# Altium schematic sheet LPCB222 - SWITCH INTERFACE.SchDoc
size A3; Address1: Factory 10; Address2: 9-13 Dingley Avenue, Dandeong, VICTORIA 3175, AUSTRALIA; DocumentNumber: 3; Revision: 1; SheetNumber: 3; SheetTotal: 3; Lockie__PCB_SUB_ASSEMBLY: Switch Interface; Lockie__PCB_ASSEMBLY: Gimbal Interface; Lockie__LDL: LPCB222; Lockie__PCB_DESCRIPTION: Gimbal Interface
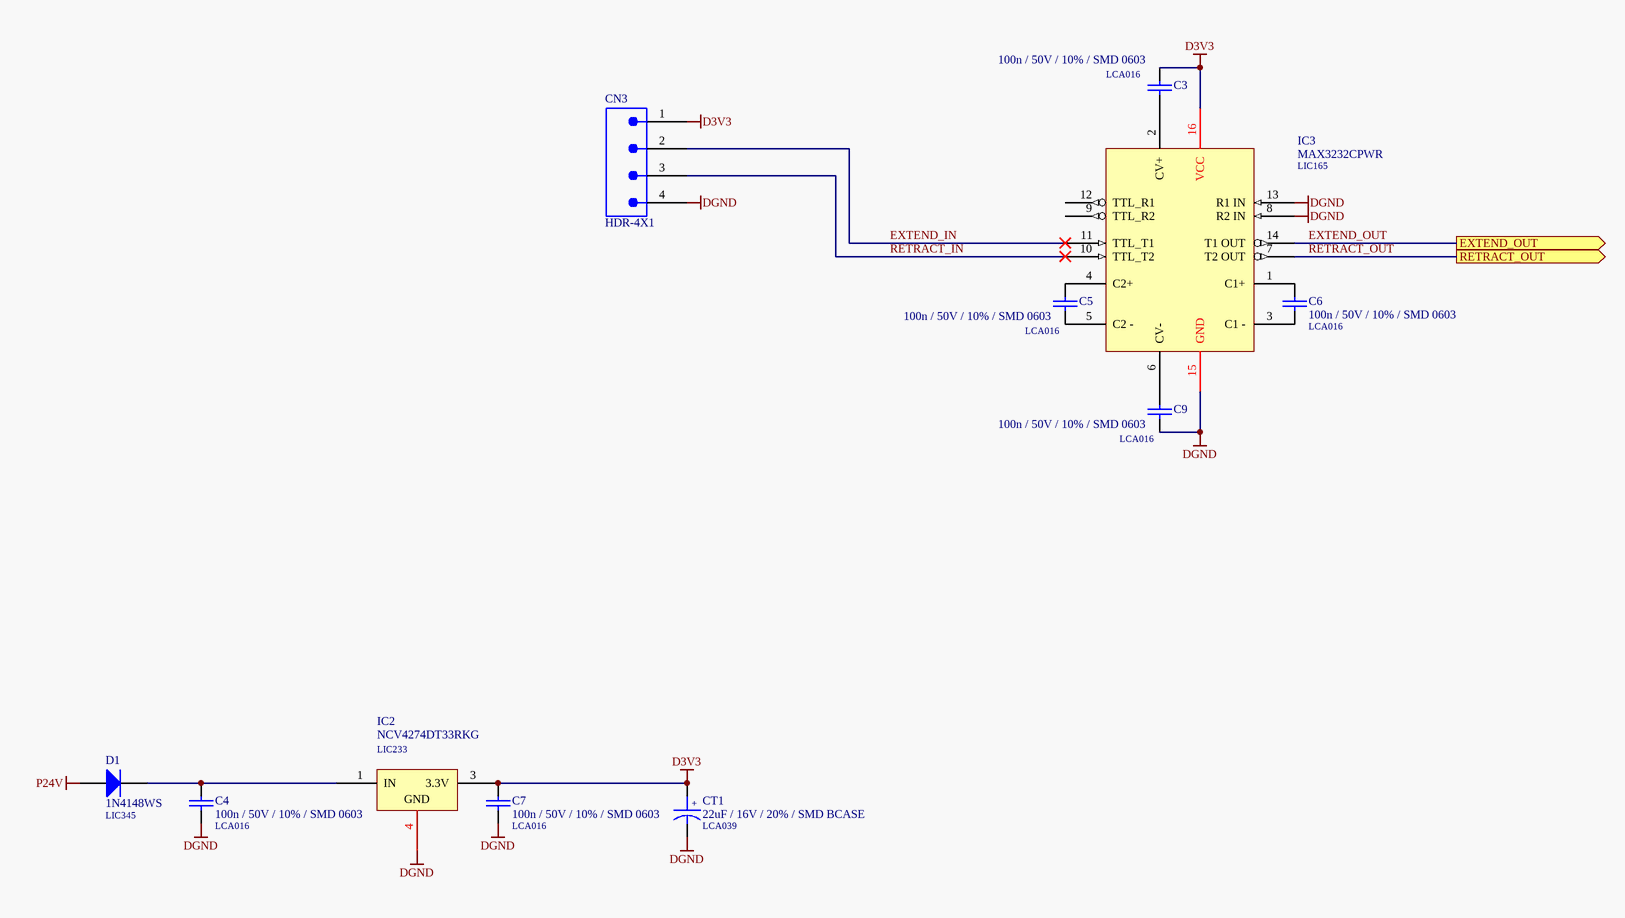
[diagram p0: LPCB222 - SWITCH INTERFACE.SchDoc]

## Parts
C3  100n / 50V / 10% / SMD 0603  LDL_NUMBER: LCA016  [LFP011__CC1608-0603-IPC7351_B]
C4  100n / 50V / 10% / SMD 0603  LDL_NUMBER: LCA016  [LFP011__CC1608-0603-IPC7351_B]
C5  100n / 50V / 10% / SMD 0603  LDL_NUMBER: LCA016  [LFP011__CC1608-0603-IPC7351_B]
C6  100n / 50V / 10% / SMD 0603  LDL_NUMBER: LCA016  [LFP011__CC1608-0603-IPC7351_B]
C7  100n / 50V / 10% / SMD 0603  LDL_NUMBER: LCA016  [LFP011__CC1608-0603-IPC7351_B]
C9  100n / 50V / 10% / SMD 0603  LDL_NUMBER: LCA016  [LFP011__CC1608-0603-IPC7351_B]
CN3  HDR-4X1  [HDR-4X1]  (no BOM)
CT1  22uF / 16V / 20% / SMD BCASE  LDL_NUMBER: LCA039  [LFP018__TC3528]
D1  1N4148WS  LDL_NUMBER: LIC345  [LFP001__SOD-323F]
IC2  NCV4274DT33RKG  LDL_NUMBER: LIC233  [LFP019__369A-13]
IC3  MAX3232CPWR  LDL_NUMBER: LIC165  [LFP049__TSSOP-16]

## Ports
EXTEND_OUT (out), RETRACT_OUT (out)

## Nets
D3V3: C3.1 C7.1 CN3.1 CT1.1 IC2.3(3.3V) IC3.16(VCC)
DGND: C4.2 C7.2 C9.2 CN3.4 CT1.2 IC2.4(GND) IC3.8(R2_IN) IC3.13(R1_IN) IC3.15(GND)
P24V: D1.2(A)
EXTEND_IN: CN3.2 IC3.11(TTL_T1)
EXTEND_OUT: IC3.14(T1_OUT) ; port EXTEND_OUT
RETRACT_IN: CN3.3 IC3.10(TTL_T2)
RETRACT_OUT: IC3.7(T2_OUT) ; port RETRACT_OUT
NetC3_2: C3.2 IC3.2(CV+)
NetC4_1: C4.1 D1.1(K) IC2.1(IN)
NetC5_1: C5.1 IC3.4(C2+)
NetC5_2: C5.2 IC3.5(C2_-)
NetC6_1: C6.1 IC3.1(C1+)
NetC6_2: C6.2 IC3.3(C1_-)
NetC9_1: C9.1 IC3.6(CV-)

Not connected (* = marked no-connect by the designer): IC3 9(TTL_R2) 12(TTL_R1)

## Notes on the sheet
- PCB COMPONENT DESCRIPTION
- LDL NUMBER
- Assembly Details
- Size
- Drawing File Name
- Revision
- http://rloop.org
- Scale
- A3
- Sheet Details
- N.T.S
- Sheet:
- Of:
- (in symbol 22uF / 16V / 20% / SMD BCASE) +

## Library data of the parts
C3 C5 C6 C9 = 100n / 50V / 10% / SMD 0603: Capacitor, Ceramic Chip, 100nF (0.1uF), 50V, 5%, SMD 0603 [LCA016]; FMEDA__OPERATING__VOLTAGE_MIN: 0; FMEDA__OPERATING__VOLTAGE_MAX: 3.3; FMEDA__OPERATING__TEMP_MIN: -20; FMEDA__OPERATING__TEMP_TYP: 27; FMEDA__OPERATING__TEMP_MAX: 50; FMEDA__CHANNEL: COM; Value: 100n; FMEDA__FUNCTION_IN_SYSTEM: *; FMEDA__OPERATING__VOLTAGE_TYP: 3.3
C4 = 100n / 50V / 10% / SMD 0603: Capacitor, Ceramic Chip, 100nF, 50V, 10%, SMD 0603; FMEDA__OPERATING__VOLTAGE_MIN: 0; FMEDA__OPERATING__VOLTAGE_MAX: 24; FMEDA__FUNCTION_IN_SYSTEM: PSU B INPUT FILTER; FMEDA__OPERATING__VOLTAGE_TYP: 12; FMEDA__OPERATING__TEMP_MIN: -20; FMEDA__OPERATING__TEMP_TYP: 27; FMEDA__OPERATING__TEMP_MAX: 50; FMEDA__CHANNEL: CH1; Value: 100n
C7 = 100n / 50V / 10% / SMD 0603: Capacitor, Ceramic Chip, 100nF, 50V, 10%, SMD 0603; FMEDA__OPERATING__VOLTAGE_MIN: 0; FMEDA__OPERATING__VOLTAGE_MAX: 5; FMEDA__FUNCTION_IN_SYSTEM: PSU B OUT FILTER; FMEDA__OPERATING__TEMP_MIN: -20; FMEDA__OPERATING__TEMP_TYP: 27; FMEDA__OPERATING__TEMP_MAX: 50; FMEDA__CHANNEL: CH1; Value: 100n; FMEDA__OPERATING__VOLTAGE_TYP: 5
CN3 = HDR-4X1: Header, 2.54mm (0.1in), 4 Pins x 1 Row (40 Per Row In Strip); FMEDA__CHANNEL: COM; FMEDA__OPERATING__CURRENT_MAX: 0; FMEDA__OPERATING__TEMP_MAX: 50; FMEDA__OPERATING__TEMP_MIN: -20; FMEDA__OPERATING__TEMP_TYP: 27; FMEDA__OPERATING__VOLTAGE_MAX: 16; FMEDA__OPERATING__VOLTAGE_TYP: 12; FMEDA__FUNCTION_IN_SYSTEM: *; FMEDA__OPERATING__CURRENT_MIN: 0; FMEDA__OPERATING__CURRENT_TYP: 0; FMEDA__OPERATING__VOLTAGE_MIN: 0
CT1 = 22uF / 16V / 20% / SMD BCASE: Capacitor, Tantalum, 22uF, 16V, 20%, SMD B-Case; Value: 22u; FMEDA__OPERATING__VOLTAGE_MAX: 5; FMEDA__OPERATING__VOLTAGE_MIN: 0; FMEDA__OPERATING__TEMP_MAX: 50; FMEDA__OPERATING__TEMP_MIN: -20; FMEDA__OPERATING__TEMP_TYP: 27; FMEDA__FUNCTION_IN_SYSTEM: PSU B OUT FILTER; FMEDA__CHANNEL: CH1; FMEDA__OPERATING__VOLTAGE_TYP: 5
D1 = 1N4148WS: Diode, Small Signal, SMD SOD-323F; FMEDA__FUNCTION_IN_SYSTEM: PSU B INPUT DIODE; FMEDA__OPERATING__TEMP_MAX: 50; FMEDA__OPERATING__TEMP_MIN: -20; FMEDA__OPERATING__TEMP_TYP: 27; FMEDA__OPERATING__VOLTAGE_MAX: 24; FMEDA__OPERATING__VOLTAGE_MIN: 0; FMEDA__OPERATING__VOLTAGE_TYP: 12; FMEDA__CHANNEL: CH1; FMEDA__OPERATING__CURRENT_MAX: 0; FMEDA__OPERATING__CURRENT_MIN: 0; FMEDA__OPERATING__CURRENT_TYP: 0
IC2 = NCV4274DT33RKG: IC, Voltage Regulator, 400mA, 3.3V LDO, SMD DPAK [LIC233]; FMEDA__OPERATING__OUTPUT_CURRENT_MIN: 0; FMEDA__OPERATING__TEMP_MAX: 50; FMEDA__OPERATING__TEMP_MIN: -20; FMEDA__OPERATING__TEMP_TYP: 27; VALUE: 0; Note: Obey Thermal Design Rules; FMEDA__CHANNEL: COM; FMEDA__OPERATING__OUTPUT_CURRENT_TYP: 0; FMEDA__OPERATING__VOLTAGE_MAX: 0; FMEDA__OPERATING__VOLTAGE_MIN: 0; FMEDA__OPERATING__VOLTAGE_TYP: 0; FMEDA__FUNCTION_IN_SYSTEM: *
IC3 = MAX3232CPWR: IC, RS232 Line Driver, 3.3V, SMD TSSOP16 [LIC165]; FMEDA__OPERATING__TEMP_MAX: 50; FMEDA__OPERATING__TEMP_MIN: -20; FMEDA__OPERATING__TEMP_TYP: 27; FMEDA__CHANNEL: COM; FMEDA__OPERATING__VOLTAGE_MAX: 3.3; FMEDA__OPERATING__VOLTAGE_MIN: 0; FMEDA__FUNCTION_IN_SYSTEM: *; FMEDA__OPERATING__VOLTAGE_TYP: 3.3